# EAGLE design Bluetooth-HC-05 (EAGLE 7.2.0)
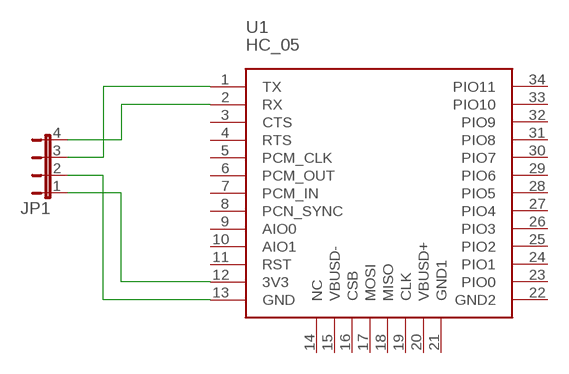
[diagram p0: schematic, sheet 1]

## Parts
JP1  JP4E  [JP4]
U1  HC_05  [BLUETOOTH_SMD]

## Nets
N$1: JP1.4 U1.2(RX)
N$2: JP1.3 U1.1(TX)
N$3: JP1.2 U1.13(GND)
N$4: JP1.1 U1.12(3V3)
Unconnected: U1.3(CTS) U1.4(RTS) U1.5(PCM_CLK) U1.6(PCM_OUT) U1.7(PCM_IN) U1.8(PCN_SYNC) U1.9(AIO0) U1.10(AIO1) U1.11(RST) U1.14(NC) U1.15(VBUSD-) U1.16(CSB) U1.17(MOSI) U1.18(MISO) U1.19(CLK) U1.20(VBUSD+) U1.21(GND1) U1.22(GND2) U1.23(PIO0) U1.24(PIO1) U1.25(PIO2) U1.26(PIO3) U1.27(PIO4) U1.28(PIO5) U1.29(PIO6) U1.30(PIO7) U1.31(PIO8) U1.32(PIO9) U1.33(PIO10) U1.34(PIO11)

## Library data of the parts
JP1 = jumper:JP4E: JUMPER
U1 = Bluetooth HC-05:HC_05: HC-05 Bluetooth Module

## Board
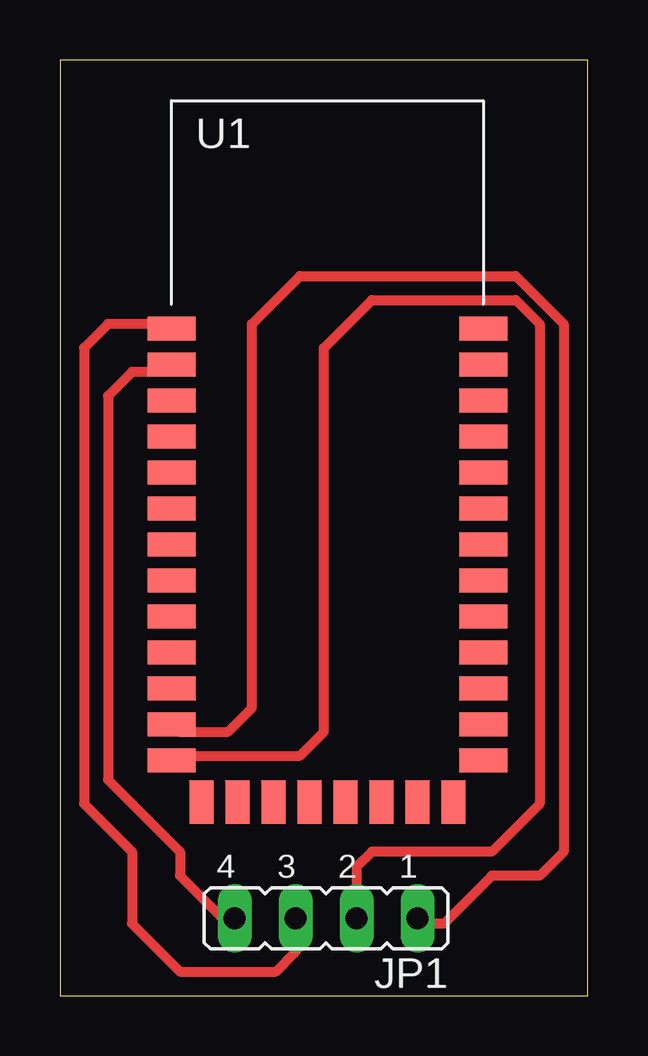
[diagram p1: board, top side]

Size 22 x 39 mm. Coordinates in mm from the lower left corner, seen from the top.
Outline: 22,39 0,39 0,0 22,0 22,39
Copper layers (1*16): Top 0.035mm / dielectric 1.5mm / Bottom 0.035mm
Design rules "default": minimum track width 10mil, minimum drill 24mil, track to track 8mil, track to pad 8mil, pad to pad 8mil, via to via 8mil, smd to smd 8mil, copper to edge 40mil, drill to drill 8mil, minimum pad ring 10mil, minimum via ring 8mil, stop-mask expansion 4mil, vias tented up to drill 0mil, thermal gap 10mil

### Footprints (pad centres in the part's own frame; a part is rotated, then mirrored left to right if it is on the bottom)
JP4 = drill 0.914 long: 1 -3.81,0; 2 -1.27,0; 3 1.27,0; 4 3.81,0
BLUETOOTH_SMD = smd 2 x 1: 1 -6.35,3.81; 2 -6.35,2.31; 3 -6.35,0.81; 4 -6.35,-0.69; 5 -6.35,-2.19; 6 -6.35,-3.69; 7 -6.35,-5.19; 8 -6.35,-6.69; 9 -6.35,-8.19; 10 -6.35,-9.69; 11 -6.35,-11.19; 12 -6.35,-12.69; 13 -6.35,-14.19; 22 6.65,-14.19; 23 6.65,-12.69; 24 6.65,-11.19; 25 6.65,-9.69; 26 6.65,-8.19; 27 6.65,-6.69; 28 6.65,-5.19; 29 6.65,-3.69; 30 6.65,-2.19; 31 6.65,-0.69; 32 6.65,0.81; 33 6.65,2.31; 34 6.65,3.81 | smd 1 x 1.8: 14 -5.1,-15.94; 15 -3.6,-15.94; 16 -2.1,-15.94; 17 -0.6,-15.94; 18 0.9,-15.94; 19 2.4,-15.94; 20 3.9,-15.94; 21 5.4,-15.94

### Placement (x,y rotation side)
JP1  11.1,3.22 180 top
U1  11,24 0 top

### Tracks (layer width: path | path; a pad name or v marks a point on that pad's centre or on a via)
N$1
  Top 0.406: U1.2 4.34,26 3,26 2,25 2,9 5,6 5,5 6.78,3.22 JP1.4
N$2
  Top 0.406: U1.1 4.46,28 2,28 1,27 1,8 3,6 3,3 5,1 9,1 9.83,1.83 JP1.3
N$3
  Top 0.406: U1.13 4.84,10 10,10 11,11 11,27 13,29 19,29 20,28 20,8 18,6 13,6 12.37,5.37 JP1.2
N$4
  Top 0.406: U1.12 4.96,11 7,11 8,12 8,28 10,30 19,30 21,28 21,6 20,5 18,5 16,3 15,3 14.91,3.09 JP1.1